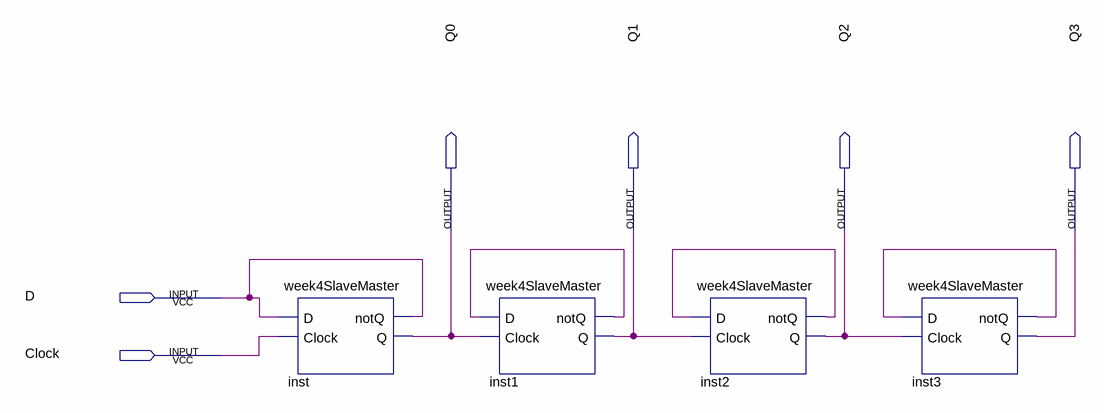
[diagram p0: schematic sheet]
// Quartus schematic week5Counter.bdf as structural Verilog: 4 symbols, 6 pins
module week5Counter (
  input  D,
  input  Clock,
  output Q0,
  output Q1,
  output Q2,
  output Q3
);

  wire inst1_notq, inst2_notq, inst3_notq;

  week4SlaveMaster inst (.D(D), .Clock(Clock), .notQ(D), .Q(Q0));
  week4SlaveMaster inst1 (.D(inst1_notq), .Clock(Q0), .notQ(inst1_notq), .Q(Q1));
  week4SlaveMaster inst2 (.D(inst2_notq), .Clock(Q1), .notQ(inst2_notq), .Q(Q2));
  week4SlaveMaster inst3 (.D(inst3_notq), .Clock(Q2), .notQ(inst3_notq), .Q(Q3));
endmodule
